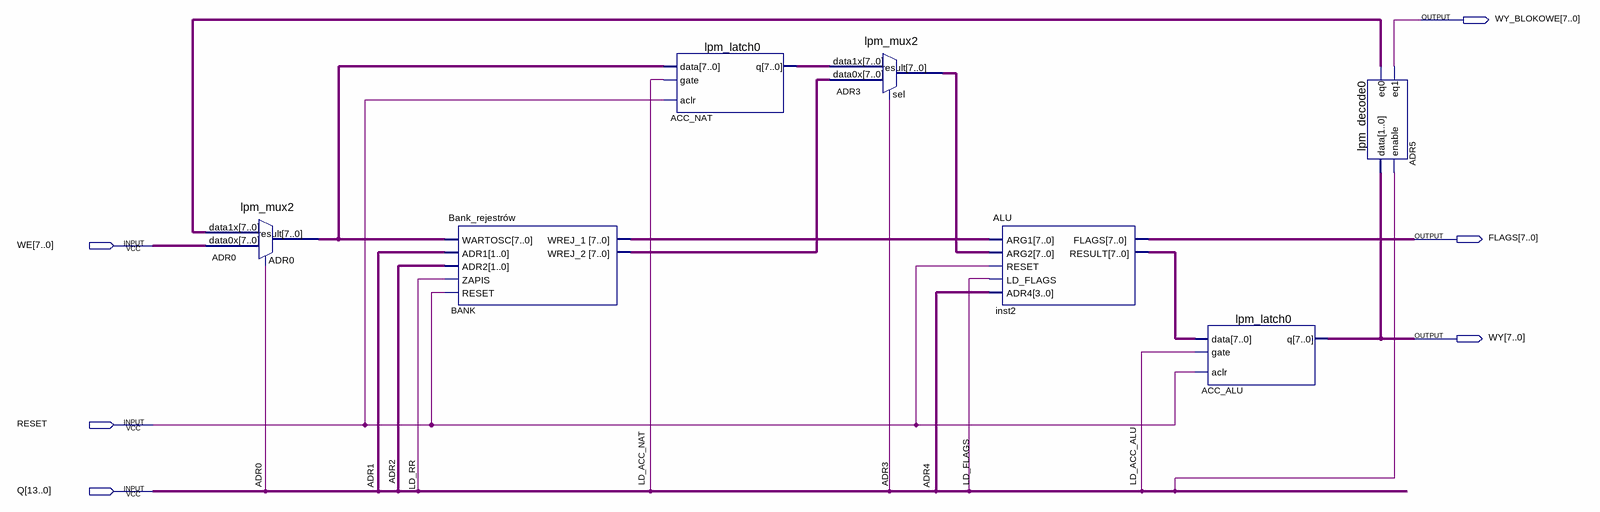
[diagram p0: schematic sheet]
// Quartus schematic Wykonawczy.bdf as structural Verilog: 7 symbols, 6 pins
module Wykonawczy (
  input  [7:0] WE,
  input  RESET,
  input  [13:0] Q,
  output [7:0] WY_BLOKOWE,
  output [7:0] FLAGS,
  output [7:0] WY
);

  wire ADR0, ADR1, ADR2, ADR3, ADR4, ADR5_eq1, LD_ACC_ALU, LD_ACC_NAT, LD_FLAGS, LD_RR, undriven;
  wire [7:0] ACC_NAT_q, ADR0_result, ADR3_result, ADR5_eq0, BANK_wrej_1, BANK_wrej_2, inst2_result;

  lpm_mux2 u_ADR0 (.data1x(ADR5_eq0), .data0x(WE), .ADR0(ADR0), .result(ADR0_result));
  \Bank_rejestrów  BANK (
    .WARTOSC(ADR0_result), .ADR1({2{ADR1}}), .ADR2({2{ADR2}}), .ZAPIS(LD_RR), .RESET(RESET),
    .WREJ_1(BANK_wrej_1), .WREJ_2(BANK_wrej_2));
  lpm_latch0 ACC_NAT (.data(ADR0_result), .gate(LD_ACC_NAT), .aclr(RESET), .q(ACC_NAT_q));
  lpm_mux2 u_ADR3 (.data1x(ACC_NAT_q), .data0x(BANK_wrej_2), .sel(ADR3), .result(ADR3_result));
  ALU inst2 (
    .ARG1(BANK_wrej_1), .ARG2(ADR3_result), .RESET(RESET), .LD_FLAGS(LD_FLAGS), .ADR4({4{ADR4}}),
    .FLAGS(FLAGS), .RESULT(inst2_result));
  lpm_latch0 ACC_ALU (.data(inst2_result), .gate(LD_ACC_ALU), .aclr(RESET), .q(WY));
  lpm_decode0 ADR5 (.data(WY), .enable(undriven), .eq0(ADR5_eq0), .eq1(ADR5_eq1));
endmodule
